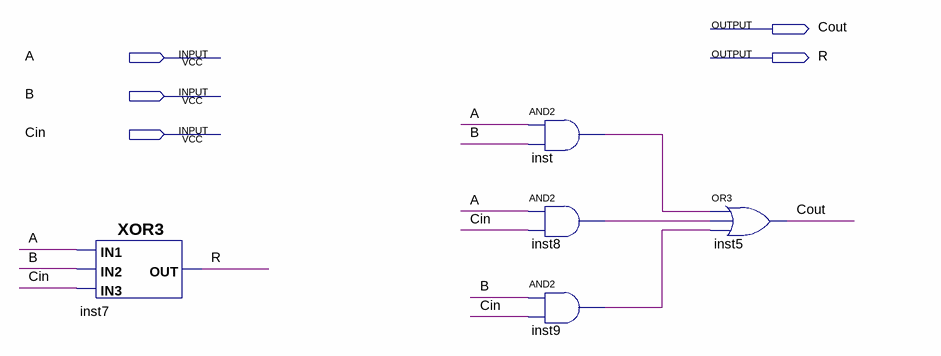
[diagram p0: schematic sheet]
// Quartus schematic OneBitAdder.bdf as structural Verilog: 5 symbols, 5 pins
module OneBitAdder (
  input  A,
  input  B,
  input  Cin,
  output Cout,
  output R
);

  wire inst8_out, inst9_out, inst_out;

  XOR3 inst7 (.IN3(Cin), .IN1(A), .IN2(B), .OUT(R));
  and inst (inst_out, A, B);
  and inst8 (inst8_out, A, Cin);
  and inst9 (inst9_out, B, Cin);
  or inst5 (Cout, inst_out, inst8_out, inst9_out);
endmodule
